# EasyEDA Pro project ProProject_FOC_Driver_2023-11-11.epro, board PCB1
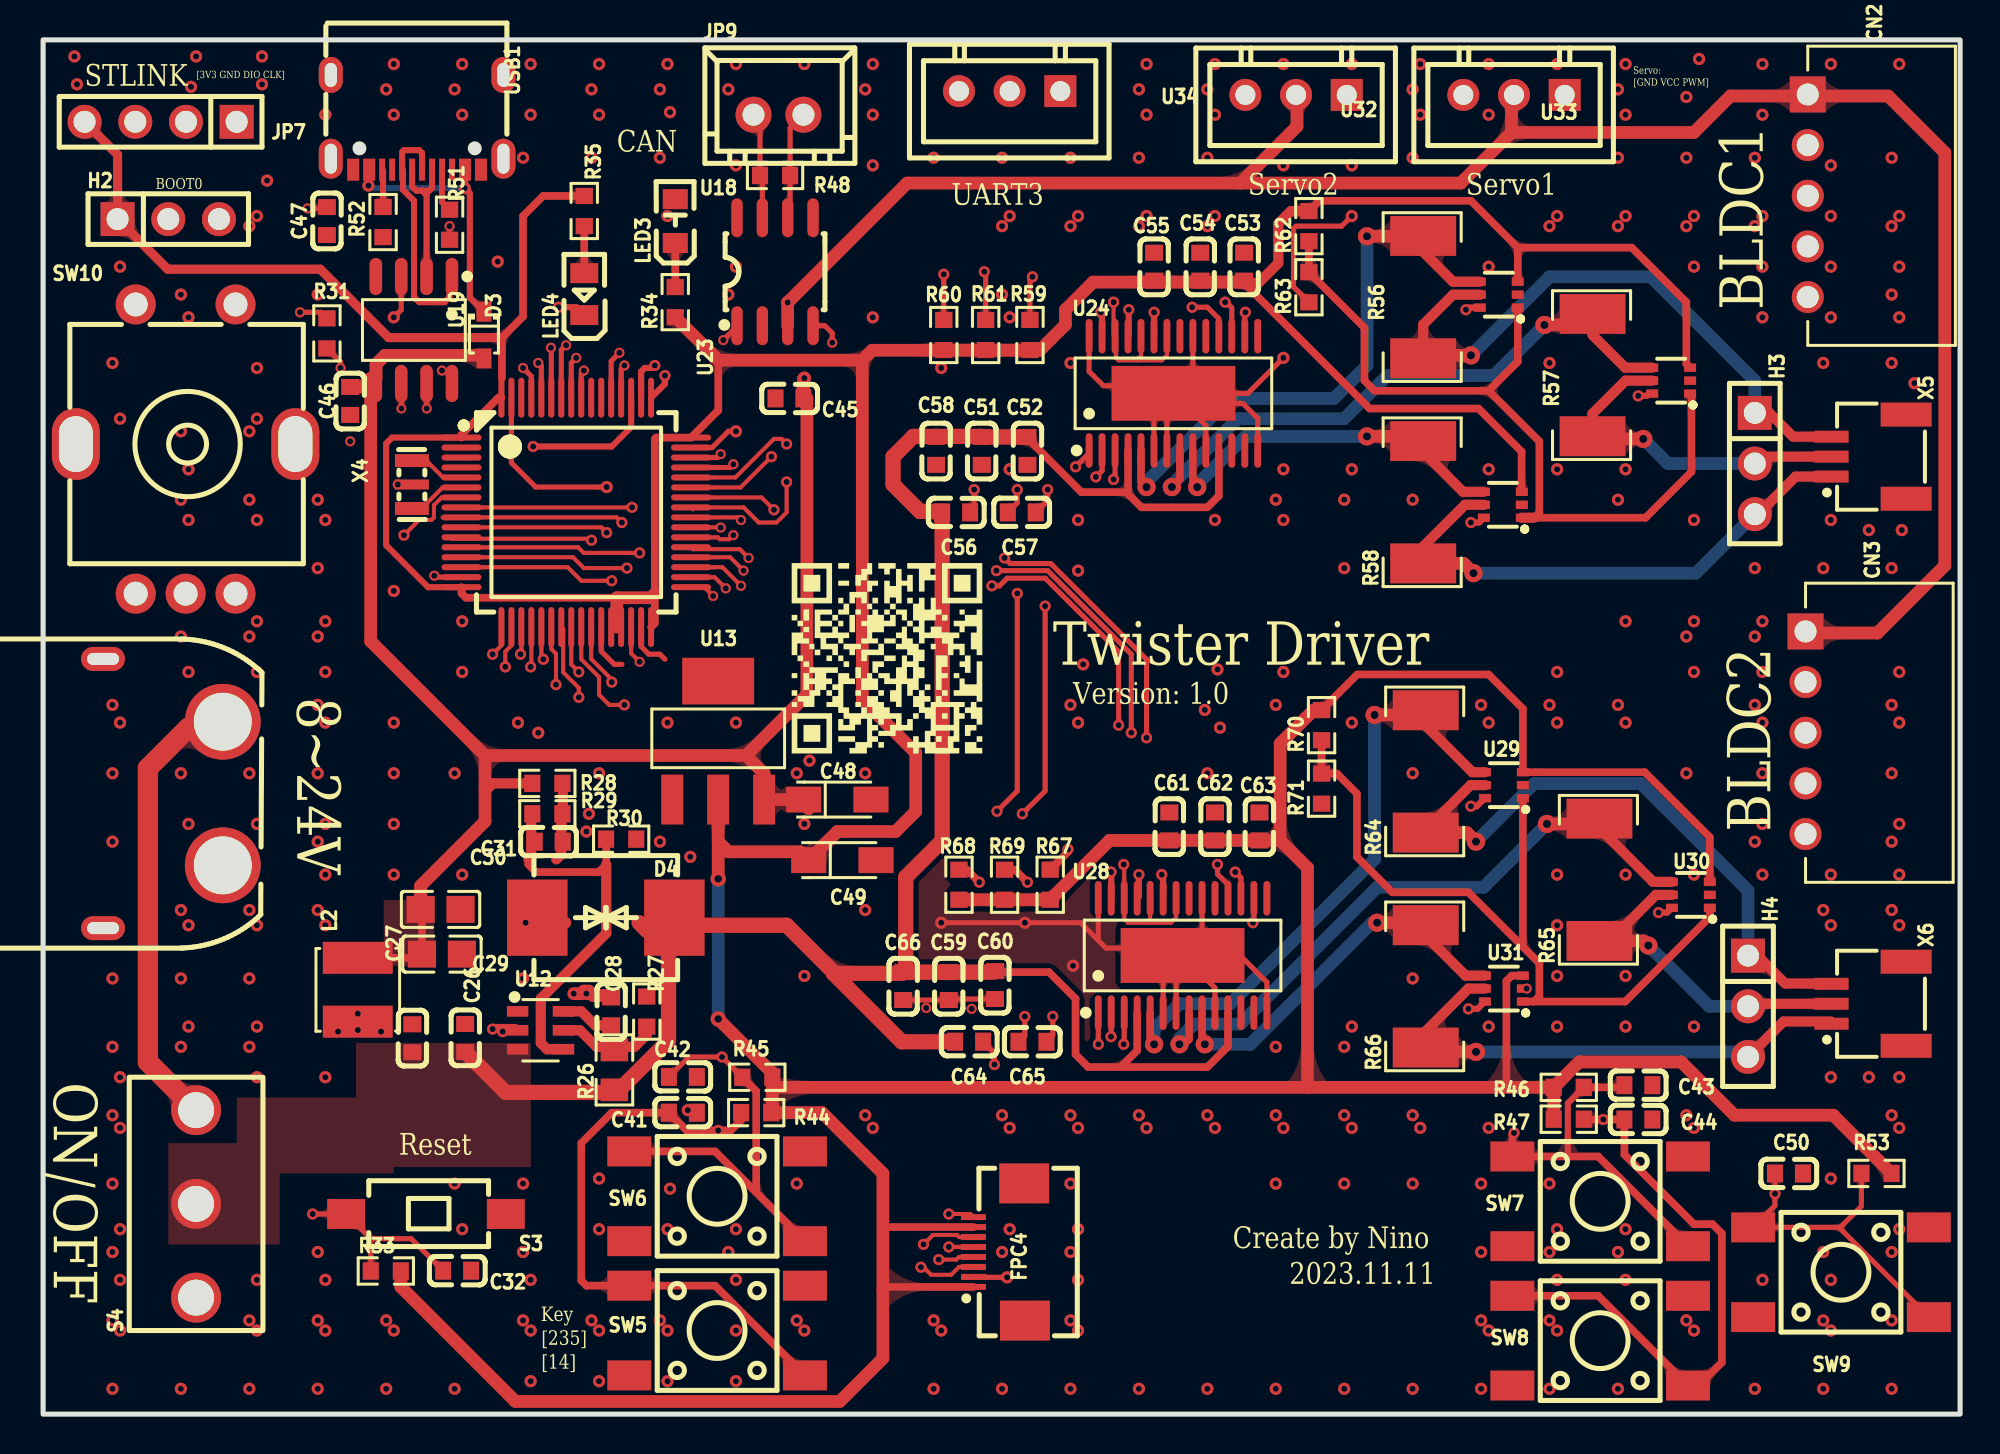
[diagram p1: board, top side]
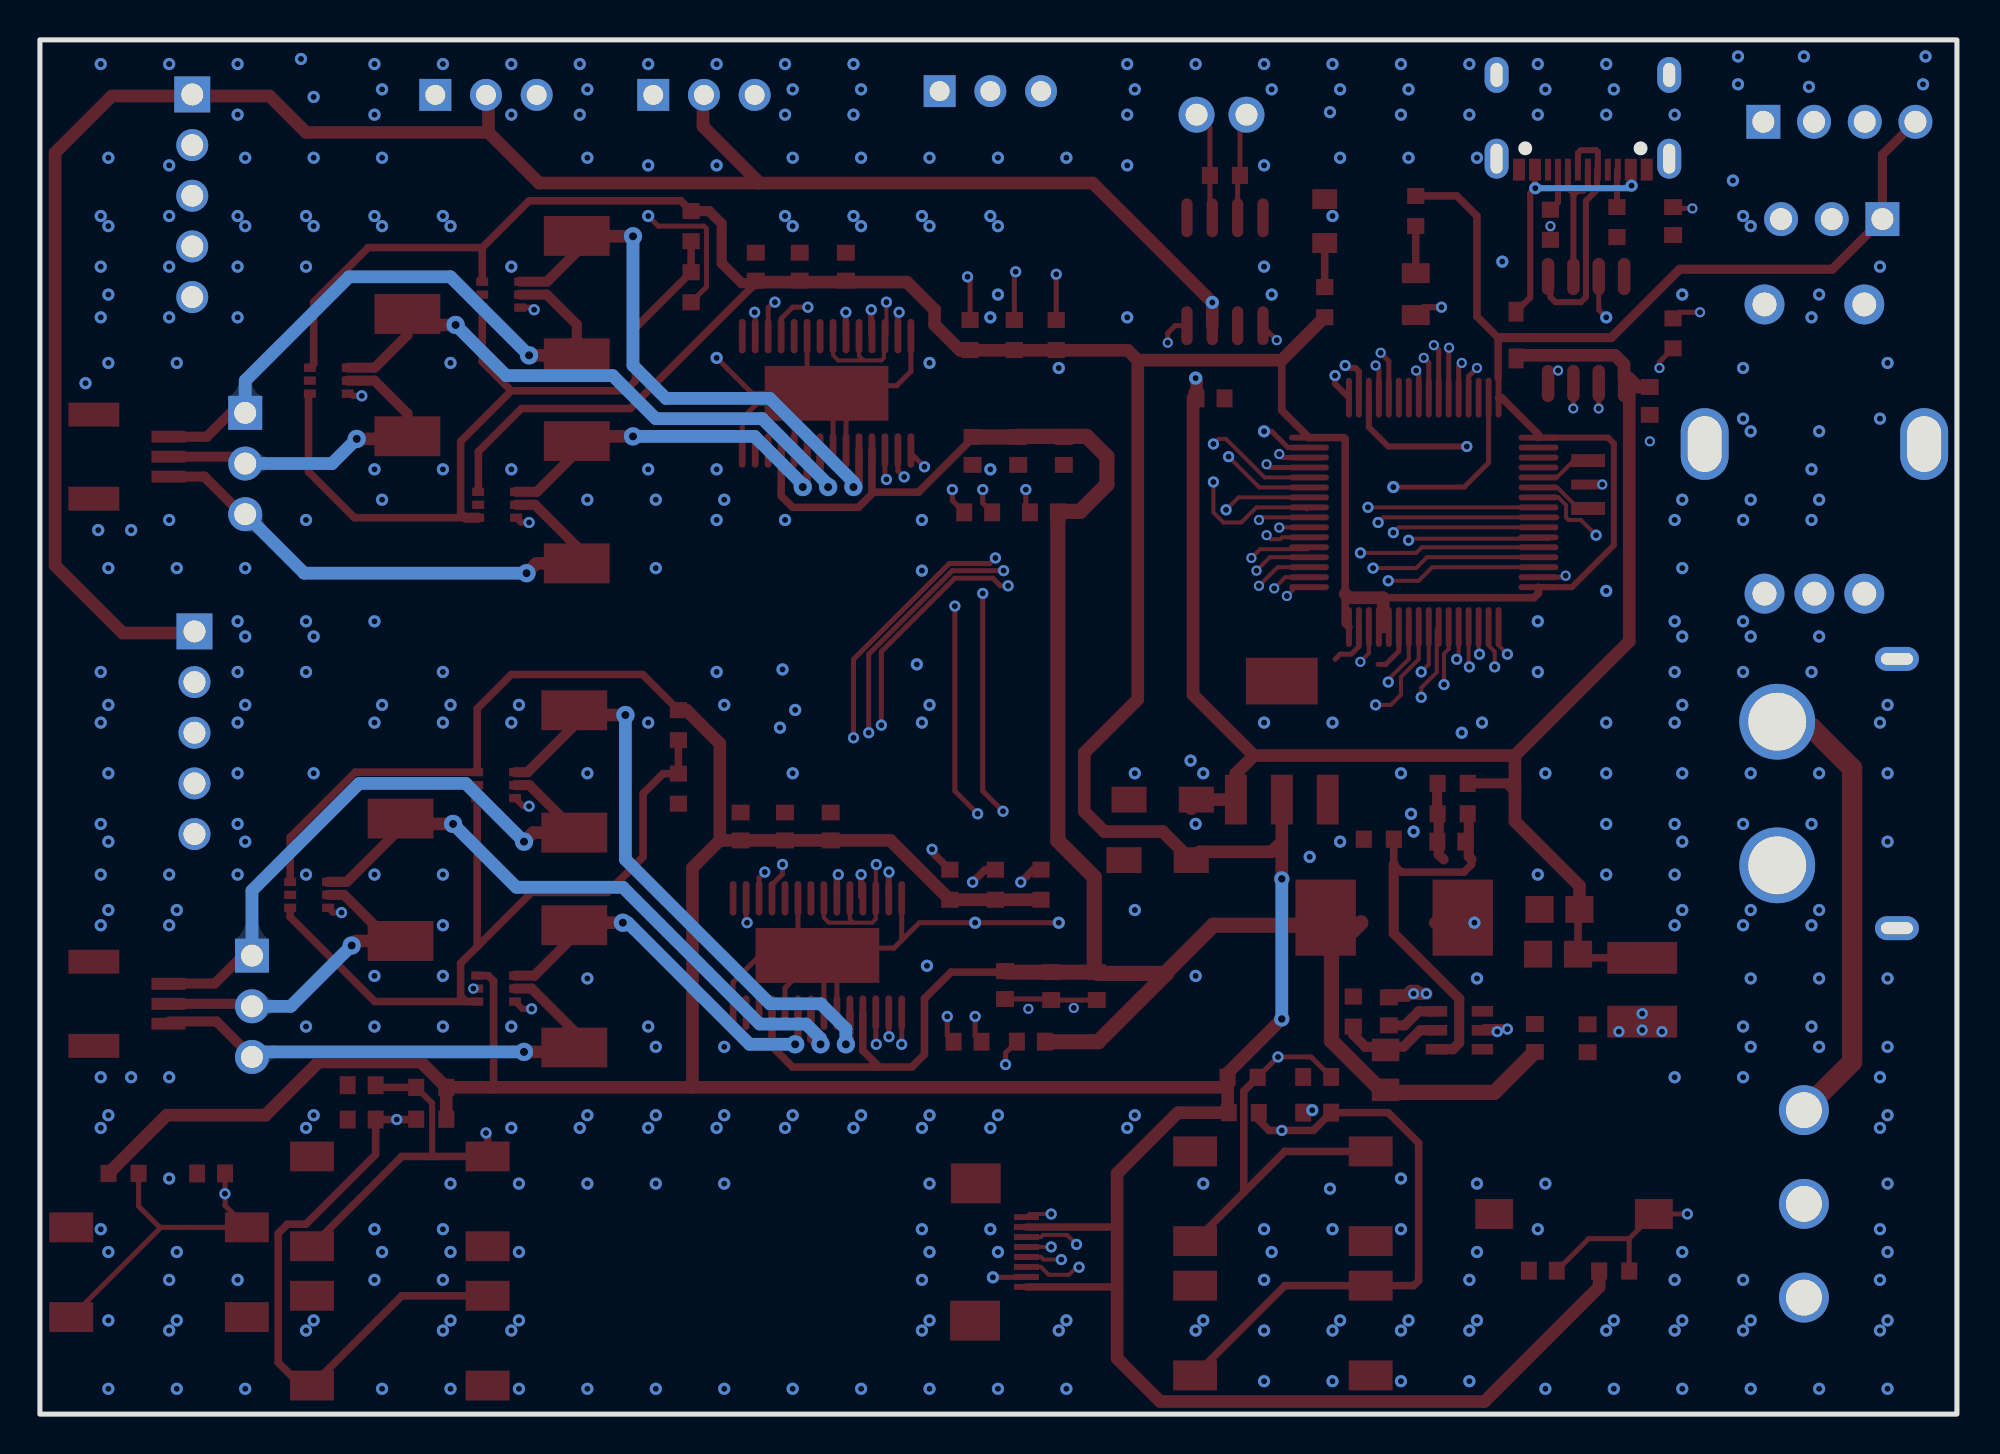
[diagram p2: board, bottom side, seen from below]

Outline 96.06 x 68.9 mm; copper layers: Top Layer, Inner1, Inner2, Bottom Layer. Coordinates in mm from the lower left corner of the outline.
Outline path: rectangle 0,68.9 96.06,0
Stack: Top Layer 0.035mm 外层铜厚1oz / Dielectric1 0.2104mm 7628 RC49% 8.6mil / Inner1 0.0152mm 内层铜厚 / Dielectric2 1.065mm 1.1mm H/HOZ 含铜 / Inner2 0.0152mm 内层铜厚 / Dielectric3 0.2104mm 7628 RC49% 8.6mil / Bottom Layer 0.035mm 外层铜厚1oz

## Design rules (mm)
template: JLCPCB Capability(Two Layers Board)
spacing copperThickness1oz (default): track to track 0.102, other pairs 0.152 to 0.3
spacing copperThickness2oz: track to track 0.203, other pairs 0.152 to 0.3
track width copperThickness1oz (default): min 0.127, default 0.254, max 2.54
track width copperThickness2oz: min 0.203, default 0.254, max 2.54
differential pair differentialPair (default): width min 0.127, default 0.254, max 2.54; gap min 0.152, default 0.152
via viaSize (default): diameter min 0.5, default 0.61, max 10; hole min 0.3, default 0.305, max 6.3

## Placement (name value [footprint] x y rotation side)
C26  100nF  [C0603]  21.15 18.86 270 top
C27  100nF  [C0603]  18.5 18.84 270 top
C28  100nF  [C0603]  28.47 20.19 90 top
C29  22uF  [C0805]  19.99 23.06 180 top
C30  22uF  [C0805]  19.92 25.31 180 top
C31  75pF  [C0603]  25.34 28.7 0 top
C32  100nF  [C0603]  20.75 7.19 180 top
C41  100nF  [C0603]  32.06 15.11 0 top
C42  100nF  [C0603]  32.06 16.91 0 top
C43  100nF  [C0603]  79.94 16.49 0 top
C44  100nF  [C0603]  79.94 14.77 0 top
C45  100nF  [C0603]  37.4 50.93 180 top
C46  100nF  [C0603]  15.39 50.8 90 top
C47  100nF  [C0603]  14.22 59.82 270 top
C48  10uF  [CAP-SMD_L3.2-W1.6-RD-C7171]  39.8 30.81 0 top
C49  10uF  [CAP-SMD_L3.2-W1.6-RD-C7171]  40.05 27.78 0 top
C50  100nF  [C0603]  87.48 12.06 0 top
C51  100nF  [C0603]  47.04 48.29 90 top
C52  100nF  [C0603]  49.33 48.29 90 top
C53  100nF  [C0603]  60.19 57.53 90 top
C54  100nF  [C0603]  57.99 57.53 90 top
C55  100nF  [C0603]  55.67 57.53 90 top
C56  100nF  [C0603]  45.75 45.21 180 top
C57  10nF  [C0603]  49.04 45.21 0 top
C58  100nF  [C0603]  44.75 48.29 90 top
C59  100nF  [C0603]  45.39 21.46 90 top
C60  100nF  [C0603]  47.7 21.51 90 top
C61  100nF  [C0603]  56.44 29.46 90 top
C62  100nF  [C0603]  58.72 29.46 90 top
C63  100nF  [C0603]  60.95 29.46 90 top
C64  100nF  [C0603]  46.4 18.67 180 top
C65  10nF  [C0603]  49.58 18.67 0 top
C66  100nF  [C0603]  43.1 21.46 90 top
CN1  XT60PW-M  [CONN-TH_XT60PW-M]  6 31.11 0 top
CN2  XH-5AW  [conn-th_5p-p2.54_xh-5aw_c2908614]  88.43 61.09 270 top
CN3  XH-5AW  [conn-th_5p-p2.54_xh-5aw_c2908614]  88.31 34.16 270 top
D3  B5819WS  [SOD-323_L1.8-W1.3-LS2.5-RD]  22.09 54.1 270 top
D4  SMDJ24CA  [SMC_L6.9-W5.9-LS7.9-BI]  28.2 24.89 0 top
FPC4  FPC-05F-8PH20  [FPC-SMD_8P-P0.50_FPC-05F-8PH20]  47.91 8.13 90 top
H2  PZ254V-11-03P  [HDR-TH_3P-P2.54-V-M]  6.27 59.92 0 top
H3  PZ254V-11-03P  [HDR-TH_3P-P2.54-V-M]  85.77 47.66 270 top
H4  PZ254V-11-03P  [HDR-TH_3P-P2.54-V-M]  85.43 20.45 270 top
JP7  PZ254V-11-04P  [HDR-TH_4P-P2.54-V-M]  5.89 64.8 180 top
JP9  XH-2A  [CONN-TH_2P-P2.50_HCTL_XH-2A-X]  36.85 65.15 0 top
L2  15uH  [IND-SMD_L4.0-W4.0]  15.77 21.28 90 top
LED3  XL-2012SURC  [LED0805-RD_RED]  31.68 59.82 90 top
LED4  NCD0805G1  [LED0805-R-RD]  27.12 56.16 90 top
R26  511kΩ  [R0805]  28.63 17.26 270 top
R27  105kΩ  [R0603]  30.25 20.18 270 top
R28  49.9Ω  [R0603]  25.27 31.62 180 top
R29  100kΩ  [R0603]  25.27 30.1 0 top
R30  13.3kΩ  [R0603]  28.97 28.83 180 top
R31  10kΩ  [R0603]  14.22 54.19 270 top
R33  10kΩ  [R0603]  17.17 7.18 0 top
R34  1kΩ  [R0603]  31.68 55.75 90 top
R35  1kΩ  [R0603]  27.12 60.32 270 top
R44  10kΩ  [R0603]  35.73 15.12 180 top
R45  10kΩ  [R0603]  35.79 16.89 180 top
R46  10kΩ  [R0603]  76.45 16.38 0 top
R47  10kΩ  [R0603]  76.45 14.79 0 top
R48  120Ω  [R0603]  36.68 62.1 180 top
R51  5.1kΩ  [R0603]  20.37 59.63 270 top
R52  5.1kΩ  [R0603]  17.04 59.77 270 top
R53  10kΩ  [R0603]  91.87 12.07 180 top
R56  10mΩ  [RES-SMD_L6.4-W3.2-R2512]  69.16 56.01 90 top
R57  10mΩ  [RES-SMD_L6.4-W3.2-R2512]  77.64 52.09 90 top
R58  10mΩ  [RES-SMD_L6.4-W3.2-R2512]  69.16 45.72 90 top
R59  10kΩ  [R0603]  49.45 54.1 270 top
R60  10kΩ  [R0603]  45.13 54.1 270 top
R61  10kΩ  [R0603]  47.23 54.1 270 top
R62  10kΩ  [R0603]  63.43 59.56 90 top
R63  10kΩ  [R0603]  63.43 56.5 90 top
R64  10mΩ  [RES-SMD_L6.4-W3.2-R2512]  69.28 32.22 90 top
R65  10mΩ  [RES-SMD_L6.4-W3.2-R2512]  77.99 26.79 90 top
R66  10mΩ  [RES-SMD_L6.4-W3.2-R2512]  69.28 21.45 90 top
R67  10kΩ  [R0603]  50.47 26.54 270 top
R68  10kΩ  [R0603]  45.89 26.54 270 top
R69  10kΩ  [R0603]  48.18 26.54 270 top
R70  10kΩ  [R0603]  64.06 34.54 90 top
R71  10kΩ  [R0603]  64.06 31.36 90 top
S3  TS-1101-C-W  [SW-SMD_L6.0-W3.3-LS8.0]  19.19 10.03 180 top
S4  SS-12D10L5  [SW-TH_SS-12D10L5]  7.67 10.54 90 top
SW5  K2-1102SP-C3SC-04  [SW-SMD_4P-L6.0-W6.0-P4.50-LS9.0]  33.77 4.19 0 top
SW6  K2-1102SP-C3SC-04  [SW-SMD_4P-L6.0-W6.0-P4.50-LS9.0]  33.77 10.92 0 top
SW7  K2-1102SP-C3SC-04  [SW-SMD_4P-L6.0-W6.0-P4.50-LS9.0]  78.03 10.67 0 top
SW8  K2-1102SP-C3SC-04  [SW-SMD_4P-L6.0-W6.0-P4.50-LS9.0]  78.03 3.68 0 top
SW9  K2-1102SP-C3SC-04  [SW-SMD_4P-L6.0-W6.0-P4.50-LS9.0]  90.09 7.11 0 top
SW10  EC11N1525404  [SW-TH_EC11NXXXX]  7.14 48.39 0 top
U12  TPS54202DDCR  [SOT-23-6_L2.9-W1.6-P0.95-LS2.8-BL]  24.93 19.24 270 top
U13  LM1117S-3.3  [SOT-223-3_L6.5-W3.4-P2.30-LS7.0-BR]  33.83 33.78 270 top
U18  TJA1050T/CM,118  [SOIC-8_L5.0-W4.0-P1.27-LS6.0-BL]  36.68 57.28 0 top
U19  CH340N  [SOP-8_L4.9-W3.9-P1.27-LS6.0-BL]  18.58 54.36 180 top
U23  STM32G431RBT6  [LQFP-64_L10.0-W10.0-P0.50-LS12.0-BL]  26.72 45.21 270 top
U24  DRV8313PWPR  [HTSSOP-28_L9.8-W4.5-P0.65-LS6.6-BL-EP]  56.64 51.18 0 top
U25  INA199A1DCKR  [SC-70-6_L2.2-W1.3-P0.65-LS2.1-BR]  72.95 56.13 0 top
U26  INA199A1DCKR  [SC-70-6_L2.2-W1.3-P0.65-LS2.1-BR]  81.58 51.82 0 top
U27  INA199A1DCKR  [SC-70-6_L2.2-W1.3-P0.65-LS2.1-BR]  73.15 45.59 0 top
U28  DRV8313PWPR  [HTSSOP-28_L9.8-W4.5-P0.65-LS6.6-BL-EP]  57.1 22.99 0 top
U29  INA199A1DCKR  [SC-70-6_L2.2-W1.3-P0.65-LS2.1-BR]  73.2 31.54 0 top
U30  INA199A1DCKR  [SC-70-6_L2.2-W1.3-P0.65-LS2.1-BR]  82.57 26.03 0 top
U31  INA199A1DCKR  [SC-70-6_L2.2-W1.3-P0.65-LS2.1-BR]  73.2 21.34 0 top
U32  ZX-XH2.54-3PZZ  [CONN-TH_3P-P2.54_2501S-3P]  62.79 66.14 180 top
U33  ZX-XH2.54-3PZZ  [CONN-TH_3P-P2.54_2501S-3P]  73.71 66.14 180 top
U34  ZX-XH2.54-3PZZ  [CONN-TH_3P-P2.54_2501S-3P]  48.43 66.33 180 top
USB1  TYPE-C 16PIN 2MD(073)  [USB-C-SMD_TYPE-C-6PIN-2MD-073]  18.74 64.77 180 top
X4  8MHz  [OSC-SMD_3P-L3.2-W1.3-P1.2-L]  18.48 46.61 270 top
X5  AFC10-S03QCA-00  [CONN-SMD_AFC10-S03QCA-00]  91.49 48.01 270 top
X6  AFC10-S03QCA-00  [CONN-SMD_AFC10-S03QCA-00]  91.49 20.57 270 top

## Footprints (pads in the part's own frame, mm; a bottom-side part is the same pattern mirrored in y, then rotated)
C0603
  rect 0.8x0.9 smd: 1(-0.7,0) 2(0.7,0)
C0805
  rect 1.41x1.35 smd: 1(-1,0) 2(1,0)
CAP-SMD_L3.2-W1.6-RD-C7171
  rect 1.758x1.296 smd: 1(-1.687,0) 2(1.687,0)
CONN-SMD_AFC10-S03QCA-00
  rect 0.6x1.71 smd: 1(1,-1.87) 2(0,-1.87) 3(-1,-1.87)
  rect 1.2x2.55 smd: 4(-2.11,1.87) 5(2.11,1.87)
CONN-TH_2P-P2.50_HCTL_XH-2A-X
  round 1.8 hole 1.1: 1(-1.251,0) 2(1.251,0)
CONN-TH_3P-P2.54_2501S-3P
  rect 1.6x1.6 hole 1: 1(-2.54,0)
  round 1.6 hole 1: 2(0,0) 3(2.54,0)
conn-th_5p-p2.54_xh-5aw_c2908614
  rect 1.8x1.8 hole 1.1: 1(-5.08,0)
  round 1.6 hole 1.1x1.001: 2(-2.54,0) 3(0,0) 4(2.54,0) 5(5.08,0)
CONN-TH_XT60PW-M
  round 3.8 hole 2.9: 1(3,-3.6) 2(3,3.6)
  oval 2.2x1.2 hole 1.6x0.6: 3(-3,6.75) 4(-3,-6.75)
FPC-SMD_8P-P0.50_FPC-05F-8PH20
  rect 0.3x1.25 smd: 1(-1.75,1.288) 2(-1.25,1.288) 3(-0.75,1.288) 4(-0.25,1.288) 5(0.25,1.288) 6(0.75,1.288) 7(1.25,1.288) 8(1.75,1.288)
  rect 2x2.5 smd: 9(3.44,-1.252) 10(-3.44,-1.288)
HDR-TH_3P-P2.54-V-M
  rect 1.7x1.7 hole 1.1: 1(-2.54,0)
  round 1.7 hole 1.1: 2(0,0) 3(2.54,0)
HDR-TH_4P-P2.54-V-M
  rect 1.7x1.7 hole 1.1: 1(-3.81,0)
  round 1.7 hole 1.1: 2(-1.27,0) 3(1.27,0) 4(3.81,0)
HTSSOP-28_L9.8-W4.5-P0.65-LS6.6-BL-EP
  oval 0.343x1.732 smd: 1(-4.225,-2.866) 2(-3.575,-2.866) 3(-2.925,-2.866) 4(-2.275,-2.866) 5(-1.625,-2.866) 6(-0.975,-2.866) 7(-0.325,-2.866) 8(0.325,-2.866) 9(0.975,-2.866) 10(1.625,-2.866) 11(2.275,-2.866) 12(2.925,-2.866) 13(3.575,-2.866) 14(4.225,-2.866) 15(4.225,2.866) 16(3.575,2.866) 17(2.925,2.866) 18(2.275,2.866) 19(1.625,2.866) 20(0.975,2.866) 21(0.325,2.866) 22(-0.325,2.866) 23(-0.975,2.866) 24(-1.625,2.866) 25(-2.275,2.866) 26(-2.925,2.866) 27(-3.575,2.866) 28(-4.225,2.866)
  rect 6.2x2.75 smd: 29(0,0)
IND-SMD_L4.0-W4.0
  rect 1.6x3.5 smd: 1(-1.6,0) 2(1.6,0)
LED0805-R-RD
  rect 1x1.399 smd: 1(1.05,0) 2(-1.05,0)
LED0805-RD_RED
  rect 1x1.25 smd: 1(-1.1,0) 2(1.1,0)
LQFP-64_L10.0-W10.0-P0.50-LS12.0-BL
  oval 0.3x2 smd: 1(-3.75,-5.75) 2(-3.25,-5.75) 3(-2.75,-5.75) 4(-2.25,-5.75) 5(-1.75,-5.75) 6(-1.25,-5.75) 7(-0.75,-5.75) 8(-0.25,-5.75) 9(0.25,-5.75) 10(0.75,-5.75) 11(1.25,-5.75) 12(1.75,-5.75) 13(2.25,-5.75) 14(2.75,-5.75) 15(3.25,-5.75) 16(3.75,-5.75) 33(3.75,5.75) 34(3.25,5.75) 35(2.75,5.75) 36(2.25,5.75) 37(1.75,5.75) 38(1.25,5.75) 39(0.75,5.75) 40(0.25,5.75) 41(-0.25,5.75) 42(-0.75,5.75) 43(-1.25,5.75) 44(-1.75,5.75) 45(-2.25,5.75) 46(-2.75,5.75) 47(-3.25,5.75) 48(-3.75,5.75)
  oval 2x0.3 smd: 17(5.75,-3.75) 18(5.75,-3.25) 19(5.75,-2.75) 20(5.75,-2.25) 21(5.75,-1.75) 22(5.75,-1.25) 23(5.75,-0.75) 24(5.75,-0.25) 25(5.75,0.25) 26(5.75,0.75) 27(5.75,1.25) 28(5.75,1.75) 29(5.75,2.25) 30(5.75,2.75) 31(5.75,3.25) 32(5.75,3.75) 49(-5.75,3.75) 50(-5.75,3.25) 51(-5.75,2.75) 52(-5.75,2.25) 53(-5.75,1.75) 54(-5.75,1.25) 55(-5.75,0.75) 56(-5.75,0.25) 57(-5.75,-0.25) 58(-5.75,-0.75) 59(-5.75,-1.25) 60(-5.75,-1.75) 61(-5.75,-2.25) 62(-5.75,-2.75) 63(-5.75,-3.25) 64(-5.75,-3.75)
OSC-SMD_3P-L3.2-W1.3-P1.2-L
  rect 0.65x1.7 smd: 1(-1.2,0) 3(1.2,0)
  rect 0.5x1.7 smd: 2(0,0)
R0603
  rect 0.806x0.864 smd: 1(-0.753,0) 2(0.753,0)
R0805
  rect 1.133x1.377 smd: 1(-1,0) 2(1,0)
RES-SMD_L6.4-W3.2-R2512
  rect 2x3.3 smd: 1(-3.067,0) 2(3.067,0)
SC-70-6_L2.2-W1.3-P0.65-LS2.1-BR
  rect 0.6x0.42 smd: 1(0.95,-0.65) 2(0.95,0) 3(0.95,0.65) 4(-0.95,0.65) 5(-0.95,0) 6(-0.95,-0.65)
SMC_L6.9-W5.9-LS7.9-BI
  rect 3.03x3.82 smd: 1(-3.435,0) 2(3.435,0)
SOD-323_L1.8-W1.3-LS2.5-RD
  rect 1x0.75 smd: 1(-1.173,0) 2(1.173,0)
SOIC-8_L5.0-W4.0-P1.27-LS6.0-BL
  oval 0.569x1.95 smd: 1(-1.905,-2.705) 2(-0.635,-2.705) 3(0.635,-2.705) 4(1.905,-2.705) 5(1.905,2.705) 6(0.635,2.705) 7(-0.635,2.705) 8(-1.905,2.705)
SOP-8_L4.9-W3.9-P1.27-LS6.0-BL
  oval 0.63x1.865 smd: 1(-1.905,-2.683) 2(-0.635,-2.683) 3(0.635,-2.683) 4(1.905,-2.683) 5(1.905,2.683) 6(0.635,2.683) 7(-0.635,2.683) 8(-1.905,2.683)
SOT-23-6_L2.9-W1.6-P0.95-LS2.8-BL
  rect 0.532x1.072 smd: 1(-0.95,-1.149) 2(0,-1.149) 3(0.95,-1.149) 4(0.95,1.149) 5(0,1.149) 6(-0.95,1.149)
SOT-223-3_L6.5-W3.4-P2.30-LS7.0-BR
  rect 2.5x1.1 smd: 1(2.97,-2.3) 2(2.97,0) 3(2.97,2.3)
  rect 2.34x3.6 smd: 4(-2.97,0)
SW-SMD_4P-L6.0-W6.0-P4.50-LS9.0
  rect 2.2x1.5 smd: 1(-4.4,2.25) 2(-4.4,-2.25) 3(4.4,2.25) 4(4.4,-2.25)
SW-SMD_L6.0-W3.3-LS8.0
  rect 1.9x1.5 smd: 1(-4,0) 2(4,0)
SW-TH_EC11NXXXX
  round 2 hole 1.2: A(-2.5,-7.25) B(2.5,-7.25) C(0,-7.25) D(-2.5,7.25) E(2.5,7.25)
  oval 2.4x3.6 hole 1.7x2.8: EH(-5.5,0.25) EH(5.5,0.25)
SW-TH_SS-12D10L5
  round 2.5 hole 1.8: 1(-4.7,0) 2(0,0) 3(4.7,0)
USB-C-SMD_TYPE-C-6PIN-2MD-073
  rect 0.6x1.1 smd: 1(-3.2,2.375) 2(-2.4,2.375) 11(2.4,2.375) 12(3.2,2.375)
  rect 0.3x1.1 smd: 3(-1.75,2.375) 4(-1.25,2.375) 5(-0.75,2.375) 6(-0.25,2.375) 7(0.25,2.375) 8(0.75,2.375) 9(1.25,2.375) 10(1.75,2.375)
  oval 1.2x2 hole 0.6x1.5: 13(-4.325,1.825) 14(4.325,1.825)
  oval 1.2x1.8 hole 0.6x1.2: 13(-4.325,-2.375) 14(4.325,-2.375)

## Nets
As in the schematic.

Pads without a net: CN2 3; CN3 3; FPC4 9 10; S4 1; SW10 EH; U13 4; U18 5; U19 4; U23 2 3 4 54 55 62; U24 12 13 15 19 21; U28 12 13 15 19 21; USB1 3 9; X5 4 5; X6 4 5

## Via types
v1: diameter 0.762, hole 0.381, Top Layer to Bottom Layer, 2 vias
v2: diameter 0.559, hole 0.305, Top Layer to Bottom Layer, 93 vias
v3: diameter 0.61, hole 0.305, Top Layer to Bottom Layer, 411 vias
v4: diameter 0.508, hole 0.305, Top Layer to Bottom Layer, 31 vias
v5: diameter 0.5, hole 0.3, Top Layer to Bottom Layer, 2 vias
v6: diameter 0.66, hole 0.305, Top Layer to Bottom Layer, 2 vias
v7: diameter 0.914, hole 0.406, Top Layer to Bottom Layer, 18 vias
v8: diameter 0.508, hole 0.3, Top Layer to Bottom Layer, 1 via

## Routing (per net, layer and track width the routed paths; a pad name or vN(x,y) marks a point on that pad's centre or on a via; arc(x,y) is an arc through that point)
+1.65V: length 40.3
  Top Layer w0.381: 72.44,51.31 74.98,48.77 74.98,45.2 74.72,44.94 80.3,44.94 82.6,47.24 82.6,51.1 U26.1 ; 72.44,51.31 66.72,51.31 66.21,51.82 66.21,54.47 R63.2 R62.1 ; 72.44,51.31 73.9,52.77 U25.1
  Top Layer w0.508: 74.72,44.94 U27.1
+1.65V_2: length 39.5
  Top Layer w0.381: U30.1 83.52,24.93 79.28,20.69 74.7,20.69 ; 74.7,20.69 74.98,20.96 74.98,22.61 74.15,23.43 ; 74.7,20.69 U31.1 ; 74.15,23.43 U29.1 ; 74.15,23.43 71.42,26.16 67.61,26.16 65.83,27.94 65.83,31.11 64.83,32.11 R71.2 R70.1
+3V3: length 403.8
  Top Layer w0.305: U23.16 19.29,41.46 17.19,43.56 17.19,48.67 17.49,48.96 U23.1
  Top Layer w0.381: R35.1 25.06,61.08 24.05,60.07 24.05,55.03 22.99,53.97 22.99,51.95 ; 73.9,58.49 73.9,56.81 ; 73.9,58.49 71.55,60.83 63.95,60.83 R62.2 ; 73.9,58.49 79.61,58.49 82.34,55.75 82.34,52.65 82.5,52.5 ; FPC4.1 42.22,6.38 42.08,6.25 ; U23.32 30.65,39.65 30.65,48.89 30.72,48.96 U23.48 33.84,50.33 33.84,52.84 ; U30.3 83.52,28.92 80.26,32.19 74.15,32.19 74.15,35.37 72.44,37.08 65.85,37.08 R70.2 ; 73.28,16.38 73.33,16.43 73.33,21.72 73.6,21.99 U31.3 ; 60.19,56.7 66.47,50.42 71.93,50.42 74.09,48.26 74.09,46.25 U27.3 ; 28.75,40.93 21.19,40.93 20.97,41.16 U23.16 ; U23.1 20.97,49.11 22.82,50.96 U23.64 ; 42.49,9.38 FPC4.7
  Top Layer w0.457: 22.99,53.97 17.32,53.97 13.89,57.4 6.25,57.4 H2.1 3.73,63.14 JP7.4
  Top Layer w0.508: 60.19,56.7 60.89,56.7 61.9,57.71 61.9,59.69 62.52,60.32 R62.2
  Top Layer w0.635: R46.1 R47.1 ; R46.1 63.36,16.38 ; R46.1 76.97,17.65 82.09,17.65 84.76,14.99 89.7,14.99 R53.1 ; 63.36,16.38 63.36,27.4 61.99,28.76 ; 63.36,16.38 36.55,16.38 ; 61.99,28.76 61.99,33.62 63.67,35.3 R70.2 ; 61.99,28.76 C63.1 C62.1 C61.1 53.44,28.76 R67.2 R69.2 R68.2 ; R62.2 63.48,60.27 ; 30.65,41.12 30.46,40.93 28.75,40.93 28.75,39.46 ; R34.1 33.84,52.84 41.05,52.84 ; 41.05,52.84 41.55,53.34 49.95,53.34 51.23,54.62 51.23,55.37 52.61,56.76 60.14,56.76 60.19,56.7 ; 41.05,52.84 41.05,35.83 43.73,33.15 43.73,30.22 42.72,29.21 39.8,29.21 C49.1 37.95,28.19 34.34,28.19 33.83,28.7 ; 33.83,28.7 U13.2 ; 33.83,28.7 v1(33.83,26.84) ; 36.55,16.38 R45.1 36.55,17.1 v1(33.83,19.81) ; 36.55,16.38 36.55,15.17 R44.1 39.03,15.12 42.08,12.06 42.08,2.79 39.93,0.63 23.67,0.63 17.93,6.38 R33.2
  Bottom Layer w0.635: v1(33.83,26.84) v1(33.83,19.81)
GND: length 81.7
  Top Layer w0.254: 58.43,51.18 60.37,51.18 v3(62.15,52.96) ; v4(20.37,59.56) 20.37,59.56 R51.2 ; 55.03,23.37 53.26,23.37 52.87,23.75 ; U28.28 52.87,23.75 ; 52.87,23.75 51.99,24.64 v3(49.2,24.64) v3(45.01,24.64) ; U23.27 27.97,38.25 28.62,37.59 29,37.59 ; U19.3 17.95,55.36 v3(17.57,54.99) ; v3(28.24,46.48) 24.69,46.48 23.47,47.7 U23.63 ; 58.89,22.99 59.98,22.99 61.32,21.65 U28.14 ; U23.31 29.97,38.48 30.35,38.1 30.91,38.1 31.16,37.85 ; 54.57,51.56 53.13,51.56 52.42,52.28 U24.28 ; U28.7 56.77,21.94 ; U28.10 58.72,21.37 58.01,22.09 ; U24.7 56.32,50.13 ; FPC4.2 46.64,6.86 v3(48.31,6.86) ; 56.19,22.09 56.12,22.02 56.12,20.13 ; U24.10 58.27,49.56 57.55,50.27 ; 57.55,52.09 57.62,52.16 U24.20 ; v3(34.72,49.28) 34.34,49.28 33.52,48.46 U23.47 ; U28.20 58.07,23.97 58.01,23.9 ; v3(65.58,60.07) 65.07,59.56 62.79,59.56 62.66,59.44 62.66,56.52 R63.1 ; C66.1 C59.1 45.44,20.81 C60.1 ; 55.73,50.27 55.67,50.21 U24.6 ; U24.14 60.87,49.93 60.12,50.67 58.72,50.67 ; v4(19.61,42.04) 19.68,41.96 U23.15
  Top Layer w0.635: 26.14,24.64 24.3,24.64
  vias: v3(1.57,68.07) v3(1.7,66.67) v3(3.48,52.7) v3(3.48,35.56) v3(3.48,32.13) v3(3.48,28.7) v3(3.48,21.84) v3(3.48,18.41) v3(3.48,14.99) v3(3.48,11.56) v3(3.48,8.13) v3(3.48,4.7) v3(3.48,1.27) v3(3.86,57.53) v3(3.86,49.91) v3(3.86,34.67) v3(3.86,16.89) v3(3.86,14.35) v3(3.86,9.27) v3(3.86,6.73) v3(3.86,4.19) v3(6.91,56.13) v3(6.91,49.28) v3(6.91,45.85) v3(6.91,38.99) v3(6.91,32.13) v3(6.91,25.27) v3(6.91,21.84) v3(6.91,18.41) v3(6.91,1.27) v3(7.29,54.99) v3(7.29,47.37) v3(7.29,44.83) v3(7.29,37.21) v3(7.29,29.59) v3(7.29,24.51) v3(7.29,19.43) v3(7.41,66.55) v3(7.67,68.07) v3(10.33,59.56) v3(10.33,49.28) v3(10.33,45.85) v3(10.33,38.99) v3(10.33,32.13) v3(10.33,25.27) v3(10.33,21.84) v3(10.33,18.41) v3(10.33,4.7) v3(10.33,1.27) v3(10.72,60.07) v3(10.72,52.45) v3(10.72,49.91) v3(10.72,44.83) v3(10.72,39.75) v3(10.72,37.21) v3(10.72,29.59) v3(10.72,24.51) v3(10.72,19.43) v3(10.72,16.89) v3(10.72,6.73) v3(10.72,4.19) v3(10.97,68.07) v3(10.97,66.67) v3(11.22,61.85) v3(13.76,56.13) v3(13.76,45.85) v3(13.76,42.42) v3(13.76,38.99) v3(13.76,35.56) v3(13.76,32.13) v3(13.76,28.7) v3(13.76,25.27) v3(13.76,8.13) v3(13.76,4.7) v3(13.76,1.27) v3(14.14,65.15) v3(14.14,44.83) v3(14.14,39.75) v3(14.14,37.21) v3(14.14,34.67) v3(14.14,29.59) v3(14.14,27.05) v3(14.14,24.51) v3(14.14,16.89) v3(14.14,6.73) v3(14.14,4.19) v3(17.19,66.42) v3(17.19,4.7) v3(17.19,1.27) v3(17.57,67.69) v3(17.57,65.15) v3(17.57,41.27) v3(17.57,34.67) v3(17.57,32.13) v3(17.57,29.59) v3(17.57,27.05) v3(17.57,4.19) v3(20.62,66.42) v3(20.62,32.13) v3(20.62,11.56) v3(20.62,1.27) v3(21,67.69) v3(21,65.15) v3(21,39.75) v3(21,37.21) v3(21,27.05) v3(21,9.27) v3(22.78,57.78) v3(23.8,34.67) v3(24.05,62.99) v3(24.05,21.84) v3(24.05,11.56) v3(24.05,8.13) v3(24.05,4.7) v3(24.18,24.64) v3(24.43,67.69) v3(24.43,65.15) v3(24.43,6.73) v3(24.43,4.19) v3(24.43,1.65) v3(24.81,34.16) v3(27.23,29.21) v3(27.35,30.1) v3(27.48,66.42) v3(27.48,62.99) v3(27.48,4.7) v3(27.86,67.69) v3(27.86,65.15) v3(27.86,32.13) v3(27.86,11.81) v3(27.86,9.27) v3(27.86,4.19) v3(27.86,1.65) v3(30.91,66.42) v3(30.91,62.99) v3(30.91,28.7) v3(30.91,4.7) v3(31.29,67.69) v3(31.29,60.07) v3(31.29,34.67) v3(31.29,9.27) v3(31.29,4.19) v3(31.29,1.65) v3(31.42,65.28) v3(31.42,11.3) v3(32.31,15.24) v3(32.43,27.94) v3(34.34,66.42) v3(34.34,56.13) v3(34.34,8.13) v3(34.72,67.69) v3(34.72,62.61) v3(34.72,57.53) v3(34.72,34.67) v3(34.72,9.27) v3(34.72,6.73) v3(34.72,4.19) v3(34.72,1.65) v3(37.77,32.13) v3(37.77,11.56) v3(37.77,4.7) v3(38.15,67.69) v3(38.15,29.59) v3(38.15,21.97) v3(38.15,4.19) v3(38.4,32.77) v3(41.2,66.42) v3(41.2,32.13) v3(41.2,25.27) v3(41.2,14.99) v3(41.58,67.69) v3(41.58,65.15) v3(41.58,62.61) v3(41.58,54.99) v3(41.58,14.35) v3(44.62,62.99) v3(44.62,4.7) v3(44.62,1.27) v3(45.01,52.45) v3(45.01,4.19) v3(48.05,62.99) v3(48.05,59.56) v3(48.05,56.13) v3(48.05,14.99) v3(48.05,8.13) v3(48.05,1.27) v3(48.43,60.07) v3(48.43,54.99) v3(48.43,47.37) v3(48.43,14.35) v3(48.43,9.27) v3(51.48,62.99) v3(51.48,59.56) v3(51.48,52.7) v3(51.48,35.56) v3(51.48,14.99) v3(51.48,11.56) v3(51.48,8.13) v3(51.48,4.7) v3(51.48,1.27) v3(51.61,22.48) v3(51.86,60.07) v3(51.86,44.83) v3(51.86,42.29) v3(51.86,34.67) v3(51.86,14.35) v3(51.86,9.27) v3(51.86,6.73) v3(51.86,4.19) v3(52.12,37.59) v3(54.91,66.42) v3(54.91,62.99) v3(54.91,59.56) v3(54.91,14.99) v3(54.91,1.27) v3(55.29,67.69) v3(55.29,65.15) v3(55.29,60.07) v3(55.29,14.35) v3(58.21,35.31) v3(58.34,66.42) v3(58.34,62.99) v3(58.34,59.56) v3(58.34,32.13) v3(58.34,14.99) v3(58.34,1.27) v3(58.72,67.69) v3(58.72,65.15) v3(58.72,60.07) v3(58.72,44.83) v3(58.72,14.35) v3(58.85,37.34) v3(58.98,34.42) v3(61.77,45.85) v3(61.77,35.56) v3(61.77,18.41) v3(61.77,14.99) v3(61.77,11.56) v3(61.77,1.27) v3(62.15,67.69) v3(62.15,62.61) v3(62.15,47.37) v3(62.15,44.83) v3(62.15,37.21) v3(62.15,14.35) v3(65.2,45.85) v3(65.2,42.42) v3(65.2,18.41) v3(65.2,14.99) v3(65.2,11.56) v3(65.2,1.27) v3(65.58,67.69) v3(65.58,62.61) v3(65.58,47.37) v3(65.58,34.67) v3(65.58,19.43) v3(65.58,14.35) v3(68.63,66.42) v3(68.63,62.99) v3(68.63,45.85) v3(68.63,32.13) v3(68.63,21.84) v3(68.63,14.99) v3(68.63,11.56) v3(68.63,1.27) v3(69.01,67.69) v3(69.01,65.15) v3(69.01,14.35) v3(72.06,35.56) v3(72.06,11.56) v3(72.06,8.13) v3(72.06,4.7) v3(72.06,1.27) v3(72.44,67.69) v3(72.44,65.15) v3(72.44,57.53) v3(72.44,47.37) v3(72.44,34.67) v3(72.44,19.43) v3(72.44,14.35) v3(72.44,4.19) v3(75.49,59.56) v3(75.49,52.7) v3(75.49,35.56) v3(75.49,11.56) v3(75.49,8.13) v3(75.49,4.7) v3(75.49,1.27) v3(75.87,67.69) v3(75.87,60.07) v3(75.87,47.37) v3(75.87,37.21) v3(75.87,34.67) v3(75.87,27.05) v3(75.87,24.51) v3(75.87,21.97) v3(75.87,19.43) v3(75.87,9.27) v3(75.87,6.73) v3(75.87,4.19) v3(78.91,66.42) v3(78.91,62.99) v3(78.91,59.56) v3(78.91,45.85) v3(78.91,35.56) v3(78.91,8.13) v3(78.91,1.27) v3(79.3,67.69) v3(79.3,65.15) v3(79.3,60.07) v3(79.3,47.37) v3(79.3,39.75) v3(79.3,34.67) v3(79.3,27.05) v3(79.3,21.97) v3(79.3,19.43) v3(79.3,9.27) v3(79.3,6.73) v3(82.34,66.04) v3(82.34,62.99) v3(82.34,59.56) v3(82.34,38.99) v3(82.34,32.13) v3(82.34,14.99) v3(82.34,4.7) v3(82.72,60.07) v3(82.72,57.53) v3(82.72,44.83) v3(82.72,39.75) v3(82.72,37.21) v3(82.72,27.05) v3(82.72,19.43) v3(82.72,14.35) v3(82.72,4.19) v3(82.98,67.94) v3(85.77,62.99) v3(85.77,59.56) v3(85.77,42.42) v3(85.77,38.99) v3(85.77,35.56) v3(85.77,28.7) v3(85.77,1.27) v3(86.15,67.69) v3(86.15,65.15) v3(86.15,60.07) v3(86.15,57.53) v3(86.15,54.99) v3(86.15,39.75) v3(86.15,37.21) v3(86.15,34.67) v3(86.15,32.13) v3(86.15,29.59) v3(86.15,27.05) v3(86.15,6.73) v3(89.2,52.7) v3(89.2,42.42) v3(89.2,25.27) v3(89.2,8.13) v3(89.2,4.7) v3(89.2,1.27) v3(89.58,67.69) v3(89.58,62.61) v3(89.58,60.07) v3(89.58,57.53) v3(89.58,54.99) v3(89.58,44.83) v3(89.58,27.05) v3(89.58,24.51) v3(89.58,16.89) v3(89.58,11.81) v3(89.58,6.73) v3(89.58,4.19) v3(91.49,44.32) v3(91.49,16.89) v3(92.63,62.99) v3(92.63,59.56) v3(92.63,56.13) v3(92.63,52.7) v3(92.63,42.42) v3(92.63,35.56) v3(92.63,32.13) v3(92.63,28.7) v3(92.63,25.27) v3(92.63,14.99) v3(92.63,8.13) v3(92.63,4.7) v3(92.63,1.27) v3(93.01,67.69) v3(93.01,60.07) v3(93.01,57.53) v3(93.01,54.99) v3(93.01,37.21) v3(93.01,34.67) v3(93.01,29.59) v3(93.01,27.05) v3(93.01,24.51) v3(93.01,16.89) v3(93.01,14.35) v3(93.01,9.27) v3(93.14,44.32) v3(93.77,51.69) v4(15.39,48.78) v4(17.77,46.61) v4(44.25,20.36) v4(46.53,20.32) v4(74.34,21.34)
VBUS: length 13.2
  Top Layer w0.305: v3(16.3,61.59) 16.34,61.63 USB1.11 ; USB1.2 21.14,61.48 v3(21.13,61.47) 21.38,61.21 21.38,55.98 D3.1
  Bottom Layer w0.305: v3(16.3,61.59) 16.43,61.47 v3(21.13,61.47)
+5: length 190.1
  Top Layer w0.381: C30.2 18.99,25.24 C29.2 18.8,22.88 L2.2
  Top Layer w0.508: 22.15,31.23 22.54,31.62 R28.2
  Top Layer w0.635: 73.58,64.26 73.58,66.02 U33.2 ; 73.58,64.26 71.04,61.72 59.99,61.72 ; 73.58,64.26 82.72,64.26 84.55,66.09 92.46,66.09 95.3,63.25 95.3,42.55 91.92,39.16 88.31,39.16 ; U18.3 v6(37.31,55.74) 43.3,61.72 59.99,61.72 ; D3.2 21.94,53.09 17.13,53.09 16.68,52.64 16.68,51.94 ; v6(38.15,51.94) 38.1,51.9 C45.1 38.27,50.93 38.27,36.07 35.23,33.02 ; 35.23,33.02 36.13,32.12 U13.3 37.91,30.81 38.37,30.35 ; 35.23,33.02 22.15,33.02 ; 59.99,61.72 62.83,64.56 62.83,66.1 U32.2 ; C30.2 18.92,26.49 22.15,29.72 22.15,33.02 ; C46.2 15.99,51.5 16.42,51.93 16.42,38.75 22.15,33.02
  Inner1 w0.635: v6(38.15,51.94) 38.15,52.58 37.26,53.47 37.26,55.75 37.39,55.88
BOOT0: length 14.7
  Top Layer w0.254: v4(24.05,52.45) 24.47,52.03 U23.61 ; v4(14.91,52.45) 14.91,52.75 R31.2
  Inner1 w0.254: v4(24.05,52.45) 21,49.4 17.32,49.4 14.92,51.8 14.92,52.18
CAN_RX: length 12.4
  Top Layer w0.254: U23.45 34.43,47.46 v4(34.59,47.62) ; v4(39.54,53.72) 39.54,54.2 39.17,54.57 U18.4
  Inner1 w0.254: v4(34.59,47.62) 35.33,47.62 39.54,51.84 v4(39.54,53.72)
CAN_TX: length 8.3
  Top Layer w0.254: v4(33.96,48.13) 33.79,47.96 U23.46 ; v4(34.08,53.85) 34.77,54.54 U18.1
  Inner1 w0.254: v4(33.96,48.13) 33.96,53.72 v4(34.08,53.85)
CANH: length 5.4
  Top Layer w0.254: JP9.1 35.92,64.83 R48.2 36.04,61.99 U18.7
CANL: length 5.5
  Top Layer w0.254: U18.6 37.43,60.1 R48.1 37.43,64.48 JP9.2
CS1: length 62.1
  Top Layer w0.203: v2(29.89,43.18) 27.09,43.18 26.81,43.46 U23.12
  Top Layer w0.305: U25.6 71.4,55.48 v2(71.29,55.37)
  Inner2 w0.305: v2(29.89,43.18) 31.3,43.18 32.69,41.79 32.69,41.02 33.78,39.93 52.99,39.93 56.39,43.33 63.83,43.33 70.53,50.04 70.53,54.61 v2(71.29,55.37)
CS2: length 66.4
  Top Layer w0.203: U23.13 26.55,42.96 27.1,42.42 v2(29.26,42.42)
  Top Layer w0.305: v2(79.93,51.05) 80.36,51.05 80.47,51.17 U26.6
  Inner2 w0.305: v2(79.93,51.05) 78.91,50.04 71.11,50.04 63.99,42.93 56.56,42.93 53.16,39.52 33.55,39.52 32.28,40.79 32.28,41.62 31.48,42.42 v2(29.26,42.42)
CS2_1: length 66.9
  Top Layer w0.203: v2(29,44.7) 28.75,44.96 U23.9 20.02,44.96
  Top Layer w0.305: U29.6 71.84,30.48 v2(71.55,30.48)
  Inner2 w0.305: v2(29,44.7) 29,43.49 27.9,42.39 27.07,42.39 26.91,42.23 26.91,41.8 29.41,39.29 30.61,39.29 31.3,38.61 46.35,38.61 56.05,28.91 56.57,28.91 59.06,26.42 67.48,26.42 v2(71.55,30.48)
CS2_2: length 73
  Top Layer w0.203: U23.10 27.98,44.46 v2(28.24,44.2)
  Top Layer w0.305: U30.6 81.38,25.15 v2(80.95,25.15)
  Inner2 w0.305: v2(80.95,25.15) 80.08,26.01 58.89,26.01 56.4,28.5 55.88,28.5 46.18,38.2 31.13,38.2 30.44,38.89 29.24,38.89 26.46,41.66 26.46,42.36 26.9,42.8 27.35,42.8 28.24,43.69 v2(28.24,44.2)
CS2_3: length 65.8
  Top Layer w0.203: U23.11 20.54,43.96 20.48,43.89 27.4,43.89 v2(27.48,43.81)
  Top Layer w0.305: U31.6 71.88,20.32 v2(71.42,20.32)
  Inner2 w0.305: v2(71.42,20.32) 63.92,20.32 56.15,28.09 55.71,28.09 46.01,37.8 30.96,37.8 30.27,38.48 29.07,38.48 25.96,41.6 25.96,42.55 27.23,43.81 v2(27.48,43.81)
CS3: length 55.6
  Top Layer w0.203: v2(28.5,41.78) 26.97,41.78 26.29,42.46 U23.14
  Top Layer w0.305: U27.6 71.96,44.7 v2(71.55,44.7)
  Inner2 w0.305: v2(28.5,41.78) 31.54,41.78 31.87,41.45 31.87,40.56 33.32,39.12 53.39,39.12 56.79,42.52 64.16,42.52 66.35,44.7 v2(71.55,44.7)
D+: length 12.5
  Top Layer w0.305: USB1.6 18.99,63.22 18.84,63.37 18.08,63.37 17.99,63.28 USB1.8 18.04,62.35 18.04,61.39 18.59,60.83 18.59,56.01 18.84,55.75 20.11,55.75 20.37,56.01 20.37,56.92 U19.1
D-: length 7.3
  Top Layer w0.305: 18.99,61.34 19.22,61.11 U19.2 ; 18.99,61.34 19.35,61.34 19.49,61.48 USB1.5 ; 18.99,61.34 18.7,61.34 18.49,61.55 USB1.7
EN: length 48.3
  Top Layer w0.203: v2(53.64,55.75) 53.64,54.12 U24.26 53.77,53.99 53.77,52.96 53.9,52.83 54.78,52.83 ; 54.78,52.83 55.02,53.06 U24.24 ; 54.78,52.83 56.05,52.83 56.32,53.09 U24.22 ; U23.24 26.47,37.59 v2(26.84,37.21)
  Inner1 w0.203: v2(26.84,37.21) 27.68,37.21 29.72,39.24 35.35,39.24 35.86,39.75 35.86,45.47 36.6,46.2 42.19,46.2 51.99,56.01 53.39,56.01 v2(53.64,55.75)
EN2: length 41.6
  Top Layer w0.203: U28.22 56.77,24.89 56.52,24.64 55.29,24.64 ; 55.29,24.64 54.36,24.64 54.17,24.82 U28.26 54.17,27.53 v2(54.15,27.56) ; 55.29,24.64 55.47,24.82 U28.24 ; U23.25 26.97,37.85 27.86,36.96 27.86,36.07 28.37,35.56 v2(29.13,35.56) 29.13,35.69
  Inner1 w0.203: 54.15,27.43 46.02,35.56 v2(29.13,35.56)
ENCD_A: length 36.7
  Top Layer w0.254: U23.58 25.97,53.35 v4(26.21,53.59)
  Inner1 w0.254: SW10.A 4.11,41.67 4.11,48.39 8.81,53.09 15.41,53.09 17.32,51.18 20.88,51.18 24.05,54.36 25.45,54.36 v4(26.21,53.59)
ENCD_B: length 46.2
  Top Layer w0.254: U23.57 26.47,52.71 v4(26.72,52.96)
  Inner1 w0.254: SW10.B 8.26,39.75 4.11,39.75 3.36,40.5 3.36,48.4 8.4,53.44 15.69,53.44 17.57,51.56 20.75,51.56 20.75,51.69 23.92,54.86 25.7,54.86 26.84,53.72 26.84,53.09 v4(26.72,52.96)
ENCD_KEY: length 36.3
  Top Layer w0.203: v2(26.84,35.94) 26.84,36.41 26.06,37.19 26.06,39.37 U23.23
  Inner2 w0.305: v2(26.84,35.94) 26.46,35.56 21.76,35.56 4.64,52.68 SW10.D
ENCODER2_SCL: length 77.3
  Top Layer w0.203: U23.22 25.47,38.36 25.7,38.13 v2(25.7,36.58)
  Inner1 w0.203: v2(25.7,36.58) 27.48,36.58 29.84,38.94 77.82,38.94 86.92,29.84 86.92,28.7 87.8,27.81 89.07,27.81 89.71,28.45 89.71,30.27 88.31,31.66
ENCODER2_SDA: length 66.1
  Top Layer w0.203: U23.42 36,45.96 v2(36.62,45.34)
  Inner1 w0.203: v2(36.62,45.34) 36.62,39.74 37.12,39.24 78.03,39.24 88.11,29.16 88.31,29.16
ENCODER_SCL: length 62.3
  Top Layer w0.203: v4(34.97,44.83) 34.84,44.96 U23.40
  Inner1 w0.203: 88.43,58.59 88.43,58.15 87.17,56.9 51.74,56.9 42.11,47.27 36.78,47.27 34.97,45.47 v4(34.97,44.83)
ENCODER_SDA: length 62.3
  Top Layer w0.203: v2(37.26,46.74) 37.26,45.21 36.75,44.7 35.86,44.7 35.1,45.46 U23.41 32.56,45.37
  Inner1 w0.203: v2(37.26,46.74) 42.21,46.74 51.86,56.39 88.13,56.39 88.43,56.09
IN1: length 43.9
  Top Layer w0.203: v2(29.51,45.47) 29.51,45.46 U23.8
  Top Layer w0.305: v2(53.01,55.24) 53.07,55.19 U24.27
  Inner2 w0.305: v2(53.01,55.24) 53.01,51.94 50.75,49.68 36.25,49.68 35.61,49.04 35.61,44.2 34.69,43.28 33.53,43.28 31.35,45.47 v2(29.51,45.47)
IN2: length 29.2
  Top Layer w0.203: v2(36.5,48.01) 34.95,46.46 U23.43
  Top Layer w0.305: v2(54.4,55.37) 54.4,54.08 U24.25
  Inner2 w0.305: v2(54.4,55.37) 54.4,52.58 51.1,49.28 36.75,49.28 36.5,49.02 v2(36.5,48.01)
IN2_1: length 50.8
  Top Layer w0.305: U23.51 29.47,49.49 28.5,48.51 v2(24.56,48.51) ; v2(53.51,27.18) 53.52,27.17 U28.27
  Inner2 w0.305: v2(53.51,27.18) 53.51,28.57 45.51,36.58 29.45,36.58 24.56,41.47 24.56,42.03 24.56,42.04 v2(24.56,48.51)
IN2_2: length 50.1
  Top Layer w0.254: v4(27.1,52.32) 26.97,52.19 U23.56
  Top Layer w0.305: v2(54.91,27.05) 54.91,25.95 54.82,25.86
  Inner2 w0.305: v2(54.91,27.05) 54.91,27.75 45.68,36.98 29.74,36.98 25.45,41.27 25.45,49.78 27.1,51.44 v4(27.1,52.32)
IN2_3: length 34
  Top Layer w0.203: U23.30 29.47,38.14 v4(29.89,37.72)
  Top Layer w0.305: v2(56.05,27.05) 56.12,26.98 56.12,25.86
  Inner2 w0.305: v2(56.05,27.05) 56.05,27.56 55.93,27.69 55.55,27.69 45.84,37.39 30.22,37.39 v4(29.89,37.72)
IN3: length 29.3
  Top Layer w0.203: U23.44 34.69,46.96 36.62,48.89 37,48.89 v2(37.26,48.64)
  Top Layer w0.305: v2(55.67,55.24) 55.67,54.05 U24.23
  Inner2 w0.305: v2(37.26,48.64) 51.23,48.64 55.67,53.09 v2(55.67,55.24)
KEY1: length 80.9
  Top Layer w0.203: U23.33 33.13,41.46 v4(33.58,41.02)
  Top Layer w0.254: v2(50.21,40.51) 50.21,31.24 v2(49.07,30.1)
  Top Layer w0.381: SW5.4 33.67,6.44 SW5.1 27.23,6.44 26.97,6.69 26.97,13.59 28.5,15.11 C41.1 32.25,14.22 v2(33.83,14.22) 34.46,14.22 34.98,14.74 R44.2
  Inner2 w0.254: v2(33.83,14.22) 33.83,14.86 v2(49.07,30.1) ; v2(50.21,40.51) 34.08,40.51 v4(33.58,41.02)
KEY2: length 68.7
  Top Layer w0.203: v4(34.21,41.4) 33.65,41.96 U23.34
  Top Layer w0.254: v2(48.82,41.15) 48.82,31.24 v2(47.8,30.23) ; R45.2 v2(34.02,17.91) 32.36,17.91 C42.1
  Top Layer w0.381: SW6.1 33.67,13.17 35.73,11.11 ; R45.2 35.73,16.19 35.73,11.11 ; 35.73,11.11 SW6.4
  Inner2 w0.254: v4(34.21,41.4) 34.72,40.89 48.56,40.89 v2(48.82,41.15) ; v2(47.8,30.23) 35.48,17.91 v2(34.02,17.91) 33.7,17.91
KEY3: length 73.6
  Top Layer w0.203: v4(34.97,41.53) 34.04,42.46 U23.35
  Top Layer w0.254: v2(53.9,34.54) 53.9,38.23 50.22,41.91 48.31,41.91 47.93,41.53 v2(47.55,41.53)
  Top Layer w0.305: R46.2 76.41,15.58 76.41,12.92
  Top Layer w0.381: SW7.4 77.93,12.92 SW7.1 73.63,14.02 v2(73.71,14.1) ; R46.2 79.13,16.38 C43.1
  Inner1 w0.254: v2(73.71,14.1) 53.9,33.91 v2(53.9,34.54)
  Inner2 w0.254: v2(47.55,41.53) v4(34.97,41.53)
KEY4: length 89.5
  Top Layer w0.203: U23.36 34.43,42.96 v4(35.1,42.29)
  Top Layer w0.254: v2(54.53,34.16) 54.53,38.1 50.34,42.29 v2(47.77,42.29)
  Top Layer w0.381: R47.2 77.22,14.77 v2(78.18,14.77) C44.1 79.24,13.01 82.72,9.52 83.65,9.52 84.12,9.06 84.12,2.59 82.96,1.43 SW8.4 77.93,5.93 SW8.1
  Inner1 w0.254: v2(54.53,34.16) 54.53,33.8 72.46,15.88 77.14,15.88 78.15,14.86
  Inner2 w0.254: v2(47.77,42.29) v4(35.1,42.29)
KEY5: length 87.2
  Top Layer w0.203: v4(35.35,42.93) 34.91,43.37 32.56,43.37 U23.37
  Top Layer w0.254: v2(48.18,42.93) 48.46,42.65 50.49,42.65 55.29,37.85 v2(55.29,33.91) ; 86.78,12.06 86.78,10.46 SW9.1 89.99,9.36 ; 89.99,9.36 SW9.4 ; 89.99,9.36 90.06,9.36 91.11,10.42 R53.2
  Inner1 w0.254: v2(86.79,11.05) 82.72,11.05 77.52,16.26 72.67,16.26 55.29,33.63 v2(55.29,33.91)
  Inner2 w0.254: v2(48.18,42.93) v4(35.35,42.93)
LCD_CS: length 38.3
  Top Layer w0.203: U23.26 27.47,37.86 28.5,36.83 v2(28.5,36.7) ; v2(45.39,10.03) 46.47,10.03 FPC4.8
  Inner1 w0.203: v2(45.39,10.03) 45.39,18.34 28.37,35.36 28.37,36.58 v2(28.5,36.7)
LCD_DC: length 43.4
  Top Layer w0.203: v2(44.88,7.75) 45.77,7.75 45.9,7.88 FPC4.4 ; U23.20 24.47,37.5 v2(24.43,37.47)
  Inner1 w0.203: v2(24.43,37.47) 24.43,36.5 25.93,35 27.86,35 44.78,18.09 44.78,10.62 44.45,10.29 44.45,9.1 44.75,8.8 44.75,7.87 v2(44.88,7.75)
LCD_RST: length 45.4
  Top Layer w0.203: v2(43.99,7.37) 44.12,7.37 44.5,6.98 45.5,6.98 45.9,7.38 FPC4.3 ; v2(23.16,37.47) 23.16,38.23 23.47,38.53 U23.18
  Inner1 w0.203: v2(23.16,37.47) 23.16,36.91 25.68,34.39 27.58,34.39 44.17,17.81 44.17,10.87 43.84,10.54 43.84,9.11 43.58,8.86 43.58,7.77 v2(43.99,7.37)
LCD_SCL: length 43.6
  Top Layer w0.203: v2(23.92,38.1) 23.97,38.14 U23.19 ; FPC4.6 45.9,8.88 45.79,8.98 44.59,8.98 v2(44.12,8.51)
  Inner1 w0.203: v2(23.92,38.1) 23.8,37.97 23.8,36.7 25.8,34.7 27.71,34.7 44.47,17.93 44.47,10.74 44.14,10.41 44.14,8.53 v2(44.12,8.51)
LCD_SDA: length 42.2
  Top Layer w0.203: v2(45.39,8.38) 46.62,8.38 FPC4.5 ; U23.21 24.97,37.94 v2(25.07,37.85)
  Inner1 w0.203: v2(25.07,37.85) 25.07,36.32 26.08,35.31 27.99,35.31 45.08,18.21 45.08,10.49 44.75,10.16 44.75,9.3 45.39,8.67 v2(45.39,8.38)
LED: length 21.8
  Top Layer w0.203: U23.17 22.97,38.54 v2(22.53,38.1)
  Top Layer w0.305: v2(25.83,55.5) 26.72,55.5 LED4.2
  Inner2 w0.305: v2(22.53,38.1) 23.03,38.61 23.03,52.32 25.83,55.12 v2(25.83,55.5)
OUT1: length 31.4
  Top Layer w0.508: 89.46,49.01 87.69,49.01 86.5,50.2 H3.1 ; R56.1 69.16,54.63 70.65,56.13 U25.5
  Top Layer w0.635: v7(71.55,53.09) 69.3,53.09 R56.1
  Bottom Layer w0.635: H3.1 85.77,51.82 80.57,57.02 75.49,57.02 v7(71.55,53.09)
OUT1_CS: length 29.2
  Top Layer w0.381: U24.5 55.02,46.76 v7(55.29,46.48)
  Top Layer w0.508: U25.4 70.65,56.78 69.16,58.27 R56.2
  Top Layer w0.635: v7(66.34,59.05) 69.14,59.05 R56.2
  Bottom Layer w0.635: v7(55.29,46.48) 55.29,46.74 59.48,50.93 64.69,50.93 66.34,52.58 v7(66.34,59.05)
OUT1_CS2: length 31.6
  Top Layer w0.381: v7(55.67,18.54) 55.47,18.74 U28.5
  Top Layer w0.508: 69.28,35.29 69.28,34.52 71.62,32.19 72.25,32.19
  Top Layer w0.635: v7(66.72,35.05) 69.05,35.05 69.28,35.29
  Bottom Layer w0.635: v7(66.72,35.05) 66.72,27.81 59.48,20.57 56.93,20.57 55.67,19.32 v7(55.67,18.54)
OUT2: length 17.5
  Top Layer w0.508: 77.64,49.03 77.64,50.16 79.3,51.82 U26.5 ; H3.2 86.12,48.01 X5.2
  Top Layer w0.635: v7(80.18,48.89) 77.78,48.89 77.64,49.03
  Bottom Layer w0.635: H3.2 81.42,47.66 v7(80.18,48.89)
OUT2_1: length 31.8
  Top Layer w0.508: R64.1 69.28,29.29 71.53,31.54 U29.5 ; H4.1 85.9,22.99 87.3,21.59 89.58,21.59
  Top Layer w0.635: R64.1 71.35,29.16 v7(71.8,28.7)
  Bottom Layer w0.635: v7(71.8,28.7) 74.72,31.62 80.06,31.62 85.43,26.25 H4.1
OUT2_2: length 17.1
  Top Layer w0.508: H4.2 85.56,20.57 X6.2 ; 78.51,23.72 80.82,26.03 U30.5
  Top Layer w0.635: v7(80.44,23.49) 80.21,23.72 R65.1
  Bottom Layer w0.635: H4.2 83.49,20.45 v7(80.44,23.49)
OUT2_3: length 25.9
  Top Layer w0.508: U31.5 71.42,21.34 69.28,19.2 R66.1 ; H4.3 87.21,19.69 89.58,19.69
  Top Layer w0.635: v7(71.8,18.16) 69.5,18.16 R66.1
  Bottom Layer w0.635: v7(71.8,18.16) 85.18,18.16 H4.3
OUT2_CS: length 31.5
  Top Layer w0.381: v7(56.56,46.48) 56.97,46.89 U24.8
  Top Layer w0.508: R57.2 77.64,54.1 79.28,52.47 80.63,52.47
  Top Layer w0.635: v7(75.23,54.61) 77.09,54.61 R57.2
  Bottom Layer w0.635: v7(56.56,46.48) 56.56,46.61 59.86,49.91 65.2,49.91 67.36,52.07 72.69,52.07 v7(75.23,54.61)
OUT2_CS2: length 33
  Top Layer w0.381: v7(56.94,18.54) 57.17,18.54 57.42,18.8 57.42,20.13
  Top Layer w0.508: R65.2 77.99,29.37 80.68,26.69 U30.4
  Top Layer w0.635: v7(75.36,29.59) 77.72,29.59 R65.2
  Bottom Layer w0.635: v7(56.94,18.54) 56.94,18.83 57.67,19.56 59.99,19.56 66.85,26.42 72.18,26.42 v7(75.36,29.59)
OUT3: length 27.4
  Top Layer w0.508: R58.1 69.16,43.5 71.25,45.59 U27.5 ; H3.3 85.93,45.12 87.82,47.01 89.58,47.01
  Top Layer w0.635: R58.1 71.19,42.65 v7(71.68,42.16)
  Bottom Layer w0.635: H3.3 82.82,42.16 v7(71.68,42.16)
OUT3_CS: length 18.9
  Top Layer w0.381: v7(57.83,46.48) 57.62,46.7 U24.9
  Top Layer w0.508: U27.4 71.15,46.24 69.16,48.24 R58.2
  Top Layer w0.635: R58.2 68.92,49.02 v7(66.34,49.02)
  Bottom Layer w0.635: v7(66.34,49.02) 60.25,49.02 57.83,46.61 v7(57.83,46.48)
OUT3_CS2: length 19.6
  Top Layer w0.381: U28.9 58.07,18.68 v7(58.21,18.54)
  Top Layer w0.508: R66.2 69.28,23.98 71.28,21.99 U31.4
  Top Layer w0.635: v7(66.85,24.64) 69.16,24.64 R66.2
  Bottom Layer w0.635: v7(58.21,18.54) 60.5,18.54 66.6,24.64 v7(66.85,24.64)
RST: length 49.3
  Top Layer w0.203: v2(18.08,44.07) 18.84,44.83 19.46,44.83 19.59,44.96 19.59,45.57 19.97,45.96 U23.7
  Top Layer w0.254: v2(13.51,10.03) S3.2 16.42,8.8 ; 16.42,8.8 18.44,8.8 20.05,7.19 ; 16.42,8.8 R33.1
  Inner1 w0.254: v2(18.08,44.07) 16.94,42.93 16.94,26.03 13.51,22.61 v2(13.51,10.03)
SWCLK: length 30
  Top Layer w0.305: U23.50 29.97,52.27 30.15,52.45 30.53,52.45 v2(30.65,52.58)
  Inner1 w0.305: JP7.1 10.44,64.8 16.3,58.93 24.18,58.93 28.24,54.86 28.24,52.68 29.08,51.84 29.92,51.84 v2(30.65,52.58)
SWDIO: length 32.7
  Top Layer w0.305: U23.49 31.16,51.66 v2(31.16,52.07)
  Inner1 w0.305: JP7.2 7.16,64.64 9.06,62.74 11.92,62.74 16.14,58.52 16.33,58.52 16.34,58.51 24.02,58.51 24.05,58.48 24.05,58.42 27.73,54.74 27.73,52.45 28.75,51.44 30.53,51.44 v2(31.16,52.07)
TIM8_CH1: length 57.9
  Top Layer w0.203: v4(33.96,44.45) 33.94,44.46 U23.39
  Inner2 w0.305: U33.1 76.25,63.63 73.33,60.71 45.07,60.71 33.32,48.96 33.32,44.96 33.83,44.45 v4(33.96,44.45)
TIM8_CH2: length 49.9
  Top Layer w0.203: U23.38 33.81,43.96 33.91,43.87 34.39,43.87 v4(34.59,44.07)
  Inner2 w0.305: U32.1 65.33,63.88 62.66,61.21 45.01,61.21 32.82,49.03 32.82,44.57 33.7,43.69 34.21,43.69 v4(34.59,44.07)
UART1_RX: length 12.3
  Top Layer w0.254: v5(17.95,50.42) 17.95,51.67 U19.6 ; v4(24.81,52.7) 24.97,52.55 U23.60
  Inner1 w0.254: v4(24.81,52.7) 24.81,53.21 24.61,53.41 24.26,53.41 20.63,49.78 18.59,49.78 v5(17.95,50.42)
UART1_TX: length 11.9
  Top Layer w0.254: U23.59 25.47,53.45 v4(25.45,53.47) ; v5(19.22,50.42) 19.22,51.67 U19.7
  Inner1 w0.254: v5(19.22,50.42) 19.48,50.16 20.49,50.16 24.3,53.97 24.94,53.97 v4(25.45,53.47)
UART3_RX: length 32.9
  Top Layer w0.254: U23.53 28.47,52.8 28.88,53.2 v4(28.88,53.21)
  Inner1 w0.254: v4(28.88,53.21) 28.88,59.94 32.69,63.75 42.59,63.75 44.62,65.79 44.62,66.8 45.26,67.44 47.33,67.44 U34.2
UART3_TX: length 28.2
  Top Layer w0.254: v8(29.13,52.58) 28.97,52.41 U23.52
  Inner1 w0.254: U34.3 42.93,63.37 32.94,63.37 29.41,59.84 29.41,52.86 v8(29.13,52.58)
VM: length 115.7
  Top Layer w0.381: 54.28,46.23 54.37,46.23 U24.4 ; 54.28,46.23 52.03,46.23 49.33,48.93 C52.2 ; 54.28,46.23 55.04,45.47 58.34,45.47 58.92,46.04 U24.11 ; 53.99,17.4 54.82,18.23 54.82,20.13 ; 53.99,17.4 58.34,17.4 59.37,18.43 U28.11 ; 53.99,17.4 52.37,17.4 51.74,18.03 51.74,20.83 50.4,22.16 47.67,22.16
  Top Layer w0.762: 43.23,22.48 43.23,26.92 45.05,28.75 C56.2 45,45.26 43.94,45.26 42.59,46.61 42.59,48.01 43.61,49.02 44.72,49.02 ; 31.34,24.26 31.34,24.51 37.26,24.51 39.54,22.22 ; 31.34,24.26 30.25,24.26 29.87,24.64 ; 31.34,24.26 31.34,18.72 28.75,16.13 23.18,16.13 C26.2 ; 44.72,49.02 47.01,49.02 C51.2 C52.2 ; 44.72,49.02 C58.2 ; 47.67,22.16 C59.2 C66.2 43.04,22.1 39.6,22.1 43.03,18.67 45.7,18.67 C64.2
$2N4633: length 5.2
  Top Layer w0.508: U12.5 26.9,19.24 27.73,18.41 29.64,18.41 30.25,19.03 R27.2
$2N4638: length 3.9
  Top Layer w0.381: v2(23.03,19.18) 23.1,19.24 23.1,19.37 ; 23.1,19.37 23.65,19.37 U12.2 ; 23.1,19.37 22.59,19.37 v2(22.53,19.3)
  Top Layer w0.635: 27.1,21.21 26.97,21.08 v2(26.59,21.08) ; 27.1,21.21 27.35,21.21 27.57,20.99 28.51,20.99 28.51,20.94 C28.2 ; 27.1,21.21 v2(27.23,21.08)
  vias: v2(14.78,19.18) v2(15.77,20.08) v2(15.77,19.26) v2(16.94,19.18)
$2N4653: length 3.4
  Top Layer w0.508: 25.72,27.81 25.97,28.06 25.97,29.98 26.05,30.06 26.05,31.11
$2N4657: length 19.2
  Top Layer w0.381: 24.32,27.81 24.32,27.56 24.7,27.18 27.84,27.18 28.22,27.56 28.22,28.82 R30.2
  Top Layer w0.508: 28.22,27.56 28.22,24.11 24.94,20.83 24.94,18.61 25.25,18.3 U12.4 ; 24.46,29.59 24.46,27.96 24.32,27.81
$2N4976: length 23
  Top Layer w1.016: CN1.2 9,34.42 7.29,34.42 5.25,32.38 5.25,17.65 S4.3
$2N5069: length 2.7
  Top Layer w0.508: U12.6 26.97,20.19 27.67,19.49 C28.1
$2N5091: length 2.2
  Top Layer w0.381: R34.2 31.68,58.72
$2N5097: length 2.4
  Top Layer w0.381: R35.2 LED4.1
$2N5145: length 13.5
  Top Layer w0.254: v4(13.26,60.45) 14.16,60.45 C47.1 ; v4(19.99,52.32) 20.12,52.32 20.49,51.95 U19.8
  Inner1 w0.254: v4(13.26,60.45) 13,60.2 13,58.55 18.59,52.96 19.35,52.96 v4(19.99,52.32)
$2N16610: length 2.2
  Top Layer w0.305: R51.1 19.99,60.77 USB1.4
$2N16673: length 1.9
  Top Layer w0.305: R52.1 17.04,62.35 USB1.10
$2N26179: length 2.8
  Top Layer w0.203: U23.5 20.05,46.96 19.2,47.81 X4.1
$2N26183: length 2.7
  Top Layer w0.203: U23.6 20.02,46.46 18.97,45.41 18.68,45.41
$2N27738: length 10.6
  Top Layer w0.254: v2(53.64,46.86) 53.72,46.94 U24.3 ; v2(46.66,46.36) 46.66,45.42 C56.1
  Inner1 w0.254: v2(53.64,46.86) 52.37,45.59 47.29,45.59 46.66,46.23 v2(46.66,46.36)
$2N27739: length 13.9
  Top Layer w0.254: R59.1 49.45,56.9 v2(49.58,57.02) ; U24.18 58.92,54.92 58.34,55.5 v2(57.58,55.5)
  Inner2 w0.254: v2(57.58,55.5) 57.58,55.62 55.54,57.66 50.21,57.66 v2(49.58,57.02)
$2N27740: length 19.9
  Top Layer w0.254: R60.1 v2(45.13,57.15) ; U24.17 59.57,55.47 59.29,55.75 v2(59.23,55.75)
  Inner2 w0.254: v2(45.13,57.15) 46.4,58.42 56.44,58.42 59.1,55.75 v2(59.23,55.75)
$2N27742: length 18.3
  Top Layer w0.254: R61.1 47.23,57.21 v2(47.16,57.28) ; U24.16 60.22,55.22 v2(60.25,55.24)
  Inner2 w0.254: v2(60.25,55.24) 60.12,55.12 58.85,55.12 55.93,58.04 47.93,58.04 v2(47.16,57.28)
$2N27749: length 5.5
  Top Layer w0.254: U24.2 53.07,47.3 v2(52.75,46.99) ; v2(50.34,46.36) 50.34,45.81 C57.2
  Inner1 w0.254: v2(50.34,46.36) 52.12,46.36 v2(52.75,46.99)
$2N27750: length 6
  Top Layer w0.254: C57.1 48.82,45.68 v2(48.82,46.36) ; v2(51.74,47.5) 52.42,48.18 U24.1
  Inner1 w0.254: v2(51.74,47.5) 51.74,47.21 51.44,46.91 49.37,46.91 v2(48.82,46.36)
$2N29231: length 9.9
  Top Layer w0.254: v2(47.67,17.53) 47.67,18.1 C64.1 ; v2(54.15,18.54) 54.17,18.57 U28.3
  Inner1 w0.254: v2(54.15,18.54) 53.13,17.53 v2(47.67,17.53)
$2N29232: length 14.8
  Top Layer w0.254: U28.18 59.37,26.55 58.85,27.07 v2(58.85,27.56)
  Top Layer w0.381: v2(51.36,28.32) 51.36,28.19 R67.1
  Inner1 w0.254: v2(51.36,28.32) 51.36,26.16 52.42,25.1 57.02,25.1 58.85,26.92 v2(58.85,27.56)
$2N29233: length 17.9
  Top Layer w0.254: U28.17 60.02,26.89 v2(59.74,27.18)
  Top Layer w0.381: R68.1 46.28,27.3 v2(46.91,26.67)
  Inner1 w0.254: v2(46.91,26.67) 47.55,27.3 49.7,27.3 52.27,24.74 57.3,24.74 v2(59.74,27.18)
$2N29235: length 15
  Top Layer w0.254: v2(60.63,24.64) 60.67,24.69 U28.16
  Top Layer w0.381: v2(49.32,26.67) 48.7,27.3 R69.1
  Inner1 w0.254: v2(49.32,26.67) 49.84,26.67 52.12,24.38 60.37,24.38 v2(60.63,24.64)
$2N29242: length 6
  Top Layer w0.254: C65.2 50.59,18.98 v2(50.59,19.94) ; U28.2 53.52,18.93 v2(53.51,18.92)
  Inner1 w0.254: v2(50.59,19.94) 52.5,19.94 v2(53.51,18.92)
$2N29243: length 7.3
  Top Layer w0.254: v2(49.2,19.94) 49.2,18.99 C65.1 ; U28.1 52.87,18.55 v2(52.88,18.54)
  Inner1 w0.254: v2(52.88,18.54) 52.24,19.18 50.09,19.18 49.32,19.94 v2(49.2,19.94)
$2N29454: length 10.9
  Top Layer w0.254: v4(12.87,55.24) 13.92,55.24 14.22,54.94
  Inner1 w0.254: v4(12.87,55.24) 10.72,57.4 7.29,57.4 6.27,58.42 H2.2

## Copper pours and planes (outline as drawn; the poured copper is in the pictures)
GND on Top Layer: 17.87,20.71 22.09,20.71 22.09,18.87 17.87,18.87
GND on Top Layer: -0.33,71.88 101.01,71.88 101.01,-1.65 -0.33,-1.65
GND on Top Layer: 20.11,26.29 25.32,26.29 25.32,19.81 20.11,19.81
GND on Top Layer: 43.86,27.86 54,27.86 54,18.67 43.86,18.67
GND on Top Layer: 20.19,26.44 22.02,26.44 22.02,18.87 20.19,18.87
GND on Bottom Layer: -6.43,75.18 101.27,75.18 101.27,-3.43 -6.43,-3.43
+5 on Top Layer: 17.07,25.77 19.61,25.77 19.61,22.48 17.07,22.48
VM on Top Layer: 15.68,18.61 24.44,18.61 24.44,12.39 15.68,12.39
VM on Top Layer: 6.27,13.59 11.86,13.59 11.86,8.51 6.27,8.51
VM on Top Layer: 9.7,15.88 17.57,15.88 17.57,12.06 9.7,12.06
$2N4638 on Bottom Layer: 14.27,22.35 29,22.35 29,18.61 14.27,18.61

Small or netless copper shapes (teardrops, artwork), in the pictures only: 485 on Top Layer, 27 on Bottom Layer, 71 on Inner1, 54 on Inner2

## Text on the board
Top Silkscreen Layer: [3V3 GND DIO CLK] | Servo: / [GND VCC PWM] | BOOT0 | Key / [235] / [14] | STLINK | Reset | CAN | UART3 | Version: 1.0 | Create by Nino / 2023.11.11 | Servo2 | Servo1 | ON/OFF | 8~24V | BLDC1 | BLDC2 | Twister Driver
